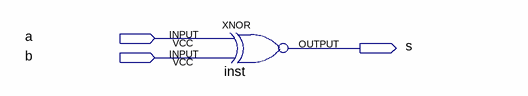
[diagram p0: schematic sheet]
// Quartus schematic comparador1.bdf as structural Verilog: 1 symbols, 3 pins
module comparador1 (
  input  a,
  input  b,
  output s
);

  xnor inst (s, a, b);
endmodule
